# Altium schematic sheet CHC_Video.SchDoc
size C
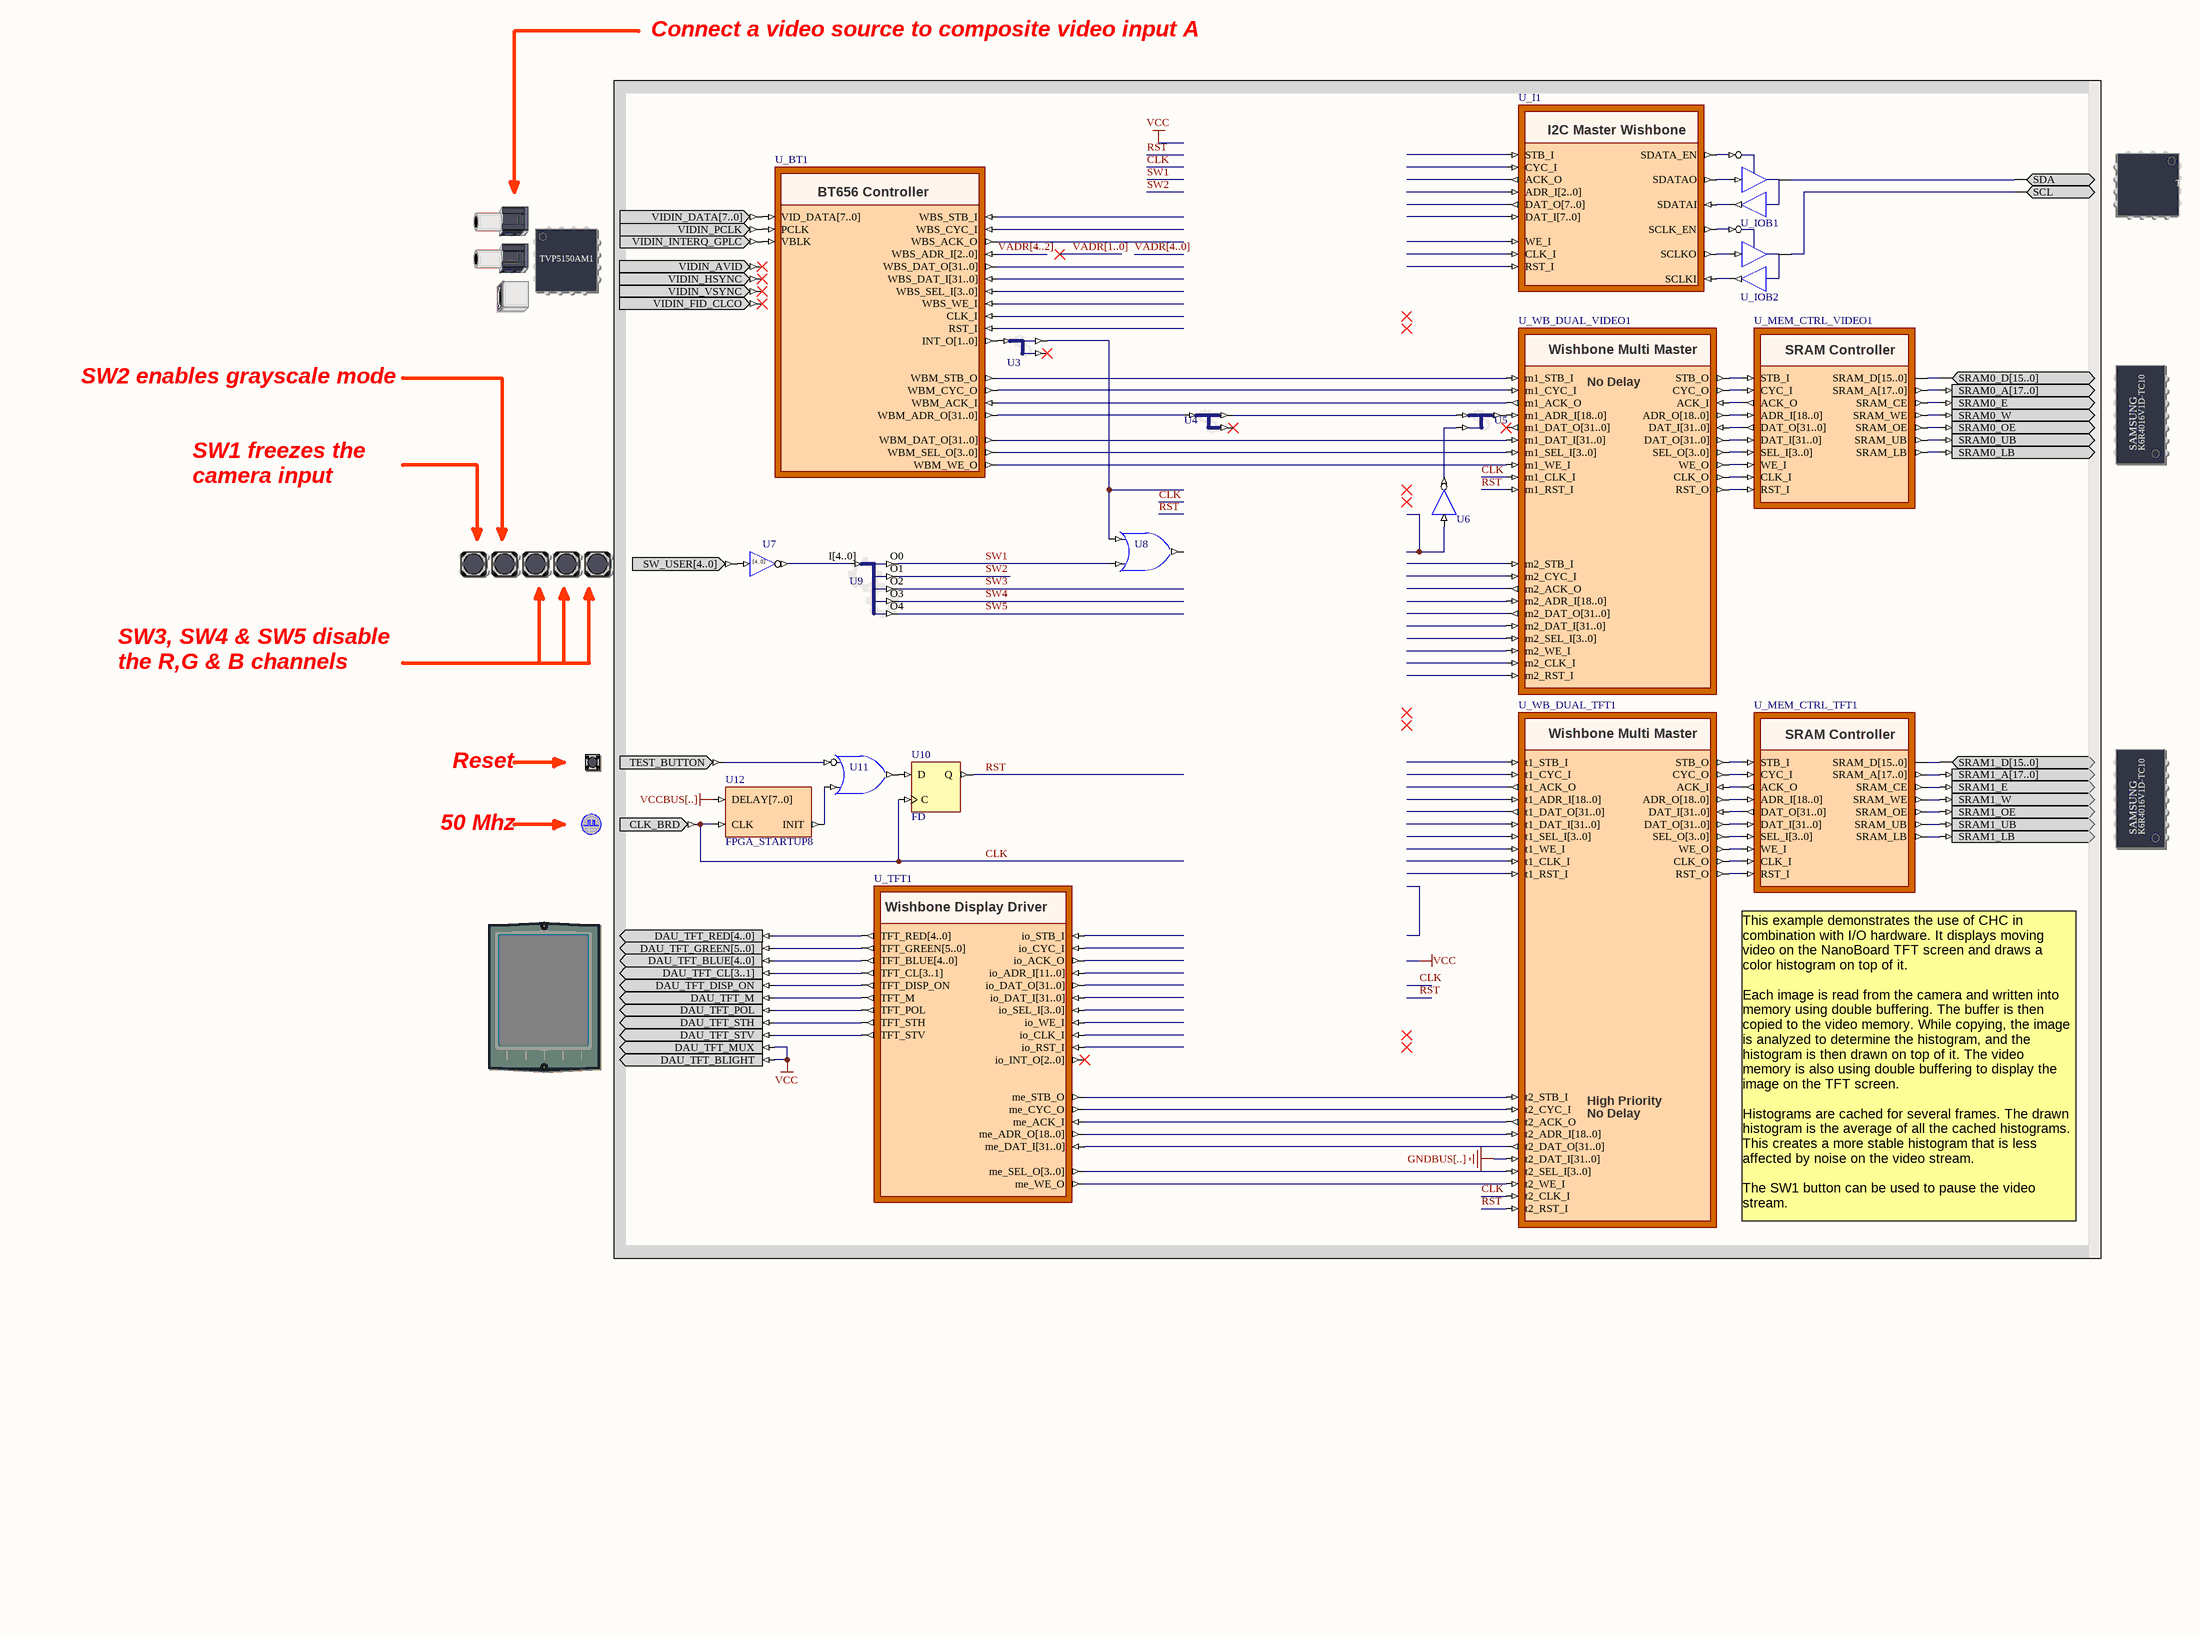
[diagram p0: CHC_Video.SchDoc]

## Parts
(Parts that share a designator on the sheet are numbered #1, #2 ... from top to bottom, then left to right.)
?#1  VIDEO_INPUT_CTRL  (value not drawn)
?#2  VIDEO_INPUT  (value not drawn)
?#3  SRAM_DAUGHTER0  (value not drawn)
?#4  USER_BUTTONS  (value not drawn)
?#5  TEST_BUTTON  (value not drawn)
?#6  SRAM_DAUGHTER1  (value not drawn)
?#7  CLOCK_BOARD  (value not drawn)
?#8  TFT_LCD  (value not drawn)
U3  BUS_JS  (value not drawn)
U4  BUS_JS  (value not drawn)
U5  BUS_JS  (value not drawn)
U6  INV  (value not drawn)
U7  INV5B  (value not drawn)
U8  OR2S  (value not drawn)
U9  BUS_JS  (value not drawn)
U10  FD
U11  OR2N1S  (value not drawn)
U12  FPGA_STARTUP8
U_BT1  BT656  (value not drawn)
U_I1  I2CM_W  (value not drawn)
U_IOB1  IOBUF  (value not drawn)
U_IOB2  IOBUF  (value not drawn)
U_MEM_CTRL_TFT1  WB_MEM_CTRL  (value not drawn)
U_MEM_CTRL_VIDEO1  WB_MEM_CTRL  (value not drawn)
U_TFT1  WB_VGA  (value not drawn)
U_WB_DUAL_TFT1  WB_MULTIMASTER  (value not drawn)
U_WB_DUAL_VIDEO1  WB_MULTIMASTER  (value not drawn)

## Nets
GNDBUS[..]: U_WB_DUAL_TFT1.t2_DAT_I[31..0]
VCC: ?#8.DAU_TFT_BLIGHT ?#8.DAU_TFT_MUX
VCCBUS[..]: U12.DELAY[7..0]
CLK: ?#7.CLK_BRD U10.C U12.CLK U_WB_DUAL_TFT1.t2_CLK_I U_WB_DUAL_VIDEO1.m1_CLK_I
RST: U10.Q U_WB_DUAL_TFT1.t2_RST_I U_WB_DUAL_VIDEO1.m1_RST_I
SW1: U8.I1 U9.O0
SW2: U9.O1
SW3: U9.O2
SW4: U9.O3
SW5: U9.O4
VADR[4..2]: U_BT1.WBS_ADR_I[2..0]
Net?#1_SCL: ?#1.SCL U_IOB2.IO
Net?#1_SDA: ?#1.SDA U_IOB1.IO
Net?#2_VIDIN_DATA[7..0]: ?#2.VIDIN_DATA[7..0] U_BT1.VID_DATA[7..0]
Net?#2_VIDIN_INTERQ_GPLC: ?#2.VIDIN_INTERQ_GPLC U_BT1.VBLK
Net?#2_VIDIN_PCLK: ?#2.VIDIN_PCLK U_BT1.PCLK
Net?#3_SRAM0_A[17..0]: ?#3.SRAM0_A[17..0] U_MEM_CTRL_VIDEO1.SRAM_A[17..0]
Net?#3_SRAM0_D[15..0]: ?#3.SRAM0_D[15..0] U_MEM_CTRL_VIDEO1.SRAM_D[15..0]
Net?#3_SRAM0_E: ?#3.SRAM0_E U_MEM_CTRL_VIDEO1.SRAM_CE
Net?#3_SRAM0_LB: ?#3.SRAM0_LB U_MEM_CTRL_VIDEO1.SRAM_LB
Net?#3_SRAM0_OE: ?#3.SRAM0_OE U_MEM_CTRL_VIDEO1.SRAM_OE
Net?#3_SRAM0_UB: ?#3.SRAM0_UB U_MEM_CTRL_VIDEO1.SRAM_UB
Net?#3_SRAM0_W: ?#3.SRAM0_W U_MEM_CTRL_VIDEO1.SRAM_WE
Net?#4_SW_USER[4..0]: ?#4.SW_USER[4..0] U7.I[4..0]
Net?#5_TEST_BUTTON: ?#5.TEST_BUTTON U11.I0
Net?#6_SRAM1_A[17..0]: ?#6.SRAM1_A[17..0] U_MEM_CTRL_TFT1.SRAM_A[17..0]
Net?#6_SRAM1_D[15..0]: ?#6.SRAM1_D[15..0] U_MEM_CTRL_TFT1.SRAM_D[15..0]
Net?#6_SRAM1_E: ?#6.SRAM1_E U_MEM_CTRL_TFT1.SRAM_CE
Net?#6_SRAM1_LB: ?#6.SRAM1_LB U_MEM_CTRL_TFT1.SRAM_LB
Net?#6_SRAM1_OE: ?#6.SRAM1_OE U_MEM_CTRL_TFT1.SRAM_OE
Net?#6_SRAM1_UB: ?#6.SRAM1_UB U_MEM_CTRL_TFT1.SRAM_UB
Net?#6_SRAM1_W: ?#6.SRAM1_W U_MEM_CTRL_TFT1.SRAM_WE
Net?#8_DAU_TFT_BLUE[4..0]: ?#8.DAU_TFT_BLUE[4..0] U_TFT1.TFT_BLUE[4..0]
Net?#8_DAU_TFT_CL[3..1]: ?#8.DAU_TFT_CL[3..1] U_TFT1.TFT_CL[3..1]
Net?#8_DAU_TFT_DISP_ON: ?#8.DAU_TFT_DISP_ON U_TFT1.TFT_DISP_ON
Net?#8_DAU_TFT_GREEN[5..0]: ?#8.DAU_TFT_GREEN[5..0] U_TFT1.TFT_GREEN[5..0]
Net?#8_DAU_TFT_M: ?#8.DAU_TFT_M U_TFT1.TFT_M
Net?#8_DAU_TFT_POL: ?#8.DAU_TFT_POL U_TFT1.TFT_POL
Net?#8_DAU_TFT_RED[4..0]: ?#8.DAU_TFT_RED[4..0] U_TFT1.TFT_RED[4..0]
Net?#8_DAU_TFT_STH: ?#8.DAU_TFT_STH U_TFT1.TFT_STH
Net?#8_DAU_TFT_STV: ?#8.DAU_TFT_STV U_TFT1.TFT_STV
NetU3_I[1..0]: U3.I[1..0] U_BT1.INT_O[1..0]
NetU3_O0: U3.O0 U8.I0
NetU4_I[31..0]: U4.I[31..0] U_BT1.WBM_ADR_O[31..0]
NetU4_O0_B[17..0]: U4.O0_B[17..0] U5.I0_B[17..0]
NetU5_I1: U5.I1 U6.O
NetU5_O[18..0]: U5.O[18..0] U_WB_DUAL_VIDEO1.m1_ADR_I[18..0]
NetU7_O[4..0]: U7.O[4..0] U9.I[4..0]
NetU10_D: U10.D U11.O
NetU11_I1: U11.I1 U12.INIT
NetU_BT1_WBM_ACK_I: U_BT1.WBM_ACK_I U_WB_DUAL_VIDEO1.m1_ACK_O
NetU_BT1_WBM_CYC_O: U_BT1.WBM_CYC_O U_WB_DUAL_VIDEO1.m1_CYC_I
NetU_BT1_WBM_DAT_O[31..0]: U_BT1.WBM_DAT_O[31..0] U_WB_DUAL_VIDEO1.m1_DAT_I[31..0]
NetU_BT1_WBM_SEL_O[3..0]: U_BT1.WBM_SEL_O[3..0] U_WB_DUAL_VIDEO1.m1_SEL_I[3..0]
NetU_BT1_WBM_STB_O: U_BT1.WBM_STB_O U_WB_DUAL_VIDEO1.m1_STB_I
NetU_BT1_WBM_WE_O: U_BT1.WBM_WE_O U_WB_DUAL_VIDEO1.m1_WE_I
NetU_I1_SCLK_EN: U_I1.SCLK_EN U_IOB2.T
NetU_I1_SCLKI: U_I1.SCLKI U_IOB2.O
NetU_I1_SCLKO: U_I1.SCLKO U_IOB2.I
NetU_I1_SDATA_EN: U_I1.SDATA_EN U_IOB1.T
NetU_I1_SDATAI: U_I1.SDATAI U_IOB1.O
NetU_I1_SDATAO: U_I1.SDATAO U_IOB1.I
NetU_MEM_CTRL_TFT1_ACK_O: U_MEM_CTRL_TFT1.ACK_O U_WB_DUAL_TFT1.ACK_I
NetU_MEM_CTRL_TFT1_ADR_I[18..0]: U_MEM_CTRL_TFT1.ADR_I[18..0] U_WB_DUAL_TFT1.ADR_O[18..0]
NetU_MEM_CTRL_TFT1_CLK_I: U_MEM_CTRL_TFT1.CLK_I U_WB_DUAL_TFT1.CLK_O
NetU_MEM_CTRL_TFT1_CYC_I: U_MEM_CTRL_TFT1.CYC_I U_WB_DUAL_TFT1.CYC_O
NetU_MEM_CTRL_TFT1_DAT_I[31..0]: U_MEM_CTRL_TFT1.DAT_I[31..0] U_WB_DUAL_TFT1.DAT_O[31..0]
NetU_MEM_CTRL_TFT1_DAT_O[31..0]: U_MEM_CTRL_TFT1.DAT_O[31..0] U_WB_DUAL_TFT1.DAT_I[31..0]
NetU_MEM_CTRL_TFT1_RST_I: U_MEM_CTRL_TFT1.RST_I U_WB_DUAL_TFT1.RST_O
NetU_MEM_CTRL_TFT1_SEL_I[3..0]: U_MEM_CTRL_TFT1.SEL_I[3..0] U_WB_DUAL_TFT1.SEL_O[3..0]
NetU_MEM_CTRL_TFT1_STB_I: U_MEM_CTRL_TFT1.STB_I U_WB_DUAL_TFT1.STB_O
NetU_MEM_CTRL_TFT1_WE_I: U_MEM_CTRL_TFT1.WE_I U_WB_DUAL_TFT1.WE_O
NetU_MEM_CTRL_VIDEO1_ACK_O: U_MEM_CTRL_VIDEO1.ACK_O U_WB_DUAL_VIDEO1.ACK_I
NetU_MEM_CTRL_VIDEO1_ADR_I[18..0]: U_MEM_CTRL_VIDEO1.ADR_I[18..0] U_WB_DUAL_VIDEO1.ADR_O[18..0]
NetU_MEM_CTRL_VIDEO1_CLK_I: U_MEM_CTRL_VIDEO1.CLK_I U_WB_DUAL_VIDEO1.CLK_O
NetU_MEM_CTRL_VIDEO1_CYC_I: U_MEM_CTRL_VIDEO1.CYC_I U_WB_DUAL_VIDEO1.CYC_O
NetU_MEM_CTRL_VIDEO1_DAT_I[31..0]: U_MEM_CTRL_VIDEO1.DAT_I[31..0] U_WB_DUAL_VIDEO1.DAT_O[31..0]
NetU_MEM_CTRL_VIDEO1_DAT_O[31..0]: U_MEM_CTRL_VIDEO1.DAT_O[31..0] U_WB_DUAL_VIDEO1.DAT_I[31..0]
NetU_MEM_CTRL_VIDEO1_RST_I: U_MEM_CTRL_VIDEO1.RST_I U_WB_DUAL_VIDEO1.RST_O
NetU_MEM_CTRL_VIDEO1_SEL_I[3..0]: U_MEM_CTRL_VIDEO1.SEL_I[3..0] U_WB_DUAL_VIDEO1.SEL_O[3..0]
NetU_MEM_CTRL_VIDEO1_STB_I: U_MEM_CTRL_VIDEO1.STB_I U_WB_DUAL_VIDEO1.STB_O
NetU_MEM_CTRL_VIDEO1_WE_I: U_MEM_CTRL_VIDEO1.WE_I U_WB_DUAL_VIDEO1.WE_O
NetU_TFT1_me_ACK_I: U_TFT1.me_ACK_I U_WB_DUAL_TFT1.t2_ACK_O
NetU_TFT1_me_ADR_O[18..0]: U_TFT1.me_ADR_O[18..0] U_WB_DUAL_TFT1.t2_ADR_I[18..0]
NetU_TFT1_me_CYC_O: U_TFT1.me_CYC_O U_WB_DUAL_TFT1.t2_CYC_I
NetU_TFT1_me_DAT_I[31..0]: U_TFT1.me_DAT_I[31..0] U_WB_DUAL_TFT1.t2_DAT_O[31..0]
NetU_TFT1_me_SEL_O[3..0]: U_TFT1.me_SEL_O[3..0] U_WB_DUAL_TFT1.t2_SEL_I[3..0]
NetU_TFT1_me_STB_O: U_TFT1.me_STB_O U_WB_DUAL_TFT1.t2_STB_I
NetU_TFT1_me_WE_O: U_TFT1.me_WE_O U_WB_DUAL_TFT1.t2_WE_I

Not connected (* = marked no-connect by the designer): ?#2 VIDIN_AVID* VIDIN_FID_CLCO* VIDIN_HSYNC* VIDIN_VSYNC*; U3 O1*; U4 O1_B[13..0]*; U6 I; U8 O; U_BT1 CLK_I RST_I WBS_ACK_O WBS_CYC_I WBS_DAT_I[31..0] WBS_DAT_O[31..0] WBS_SEL_I[3..0] WBS_STB_I WBS_WE_I; U_I1 ACK_O ADR_I[2..0] CLK_I CYC_I DAT_I[7..0] DAT_O[7..0] INT_O RST_I STB_I WE_I; U_TFT1 io_ACK_O io_ADR_I[11..0] io_CLK_I io_CYC_I io_DAT_I[31..0] io_DAT_O[31..0] io_INT_O[2..0]* io_RST_I io_SEL_I[3..0] io_STB_I io_WE_I; U_WB_DUAL_TFT1 t1_ACK_O t1_ADR_I[18..0] t1_CLK_I t1_CYC_I t1_DAT_I[31..0] t1_DAT_O[31..0] t1_RST_I t1_SEL_I[3..0] t1_STB_I t1_WE_I; U_WB_DUAL_VIDEO1 m1_DAT_O[31..0]* m2_ACK_O m2_ADR_I[18..0] m2_CLK_I m2_CYC_I m2_DAT_I[31..0] m2_DAT_O[31..0] m2_RST_I m2_SEL_I[3..0] m2_STB_I m2_WE_I

## Buses and harness runs
bus VADR[1..0]
bus VADR[4..0]
bus VADR[4..2]

## Notes on the sheet
- Connect a video source to composite video input A
- SW2 enables grayscale mode
- SW1 freezes the
- camera input
- SW3, SW4 & SW5 disable
- the R,G & B channels
- Reset
- 50 Mhz
- This example demonstrates the use of CHC in combination with I/O hardware. It displays moving video on the NanoBoard TFT screen and draws a color histogram on top of it.
  Each image is read from the camera and written into memory using double buffering. The buffer is then copied to the video memory. While copying, the image is analyzed to determine the histogram, and the histogram is then drawn on top of it. The video memory is also using double buffering to display the image on the TFT screen.
  Histograms are cached for several frames. The drawn histogram is the average of all the cached histograms. This creates a more stable histogram that is less affected by noise on the video stream.
  The SW1 button can be used to pause the video stream.
- Title
- Size:
- Date:
- File:
- C
- Number:
- Time:
- Revision:
- Sheet
- of
- (in symbol BT656) BT656 Controller
- (in symbol INV5B) [4..0]
- (in symbol SRAM_DAUGHTER0) SAMSUNG; K6R4016V1D-TC10
- (in symbol SRAM_DAUGHTER1) SAMSUNG; K6R4016V1D-TC10
- (in symbol VIDEO_INPUT) TVP5150AM1
- (in symbol VIDEO_INPUT_CTRL) TVP5150AM1
- (in symbol WB_MEM_CTRL) SRAM Controller
- (in symbol WB_MULTIMASTER) Wishbone Multi Master; High Priority; No Delay

## Library data of the parts
?#1 = VIDEO_INPUT_CTRL: Video Input Control; PortComponent: True; Published: 22-Jan-2007; Publisher: Altium Limited; HelpURL: TR0145 Technical Reference for Altium's Audio-Video Peripheral Board PB01.pdf#page=8
?#2 = VIDEO_INPUT: Video Inputs; PortComponent: True; Published: 22-Jan-2007; Publisher: Altium Limited; HelpURL: TR0145 Technical Reference for Altium's Audio-Video Peripheral Board PB01.pdf#page=7
?#3 = SRAM_DAUGHTER0: Free Static RAM - Daughterboard; PortComponent: True; Published: 14-May-2007; Publisher: Altium Limited; HelpURL: TR0149 Technical Reference for Altium's Xilinx Spartan-3 Daughter Board DB30.pdf#page=16
?#4 = USER_BUTTONS: Generic User Buttons; PortComponent: True; Published: 16-Apr-2007; Publisher: Altium Limited; HelpURL: TR0143 Technical Reference Manual for Altium's Desktop NanoBoard NB2DSK01.pdf#page=53
?#5 = TEST_BUTTON: Test / Reset Button; PortComponent: True; Published: 19-Nov-2003; Publisher: Altium Limited; HelpURL: TR0143 Technical Reference Manual for Altium's Desktop NanoBoard NB2DSK01.pdf#page=53
?#6 = SRAM_DAUGHTER1: Free Static RAM - Daughterboard; PortComponent: True; Published: 14-May-2007; Publisher: Altium Limited; HelpURL: TR0149 Technical Reference for Altium's Xilinx Spartan-3 Daughter Board DB30.pdf#page=16
?#7 = CLOCK_BOARD: Global System Clock Supply; PortComponent: True; Published: 19-Nov-2003; Publisher: Altium Limited; HelpURL: TR0143 Technical Reference Manual for Altium's Desktop NanoBoard NB2DSK01.pdf#page=41; UseInDSF: True
?#8 = TFT_LCD: TFT LCD Panel; PortComponent: True; Published: 22-Jan-2007; Publisher: Altium Limited; HelpURL: TR0143 Technical Reference Manual for Altium's Desktop NanoBoard NB2DSK01.pdf#page=50
U3 = BUS_JS: Configurable Bus Joiner/Splitter; ConfiguratorName: GENERIC_BUS_JS; ConfigurationParameters: {}Version[1.1]{}SplitterJoinerType[Splitter]{}SignalCount[2]{}SignalWidth0[1]{}GapBelow0[1000000]{}ConnectionType0[Pin]{}SignalWidth1[1]{}GapBelow1[1000000]{}ConnectionType1[Pin]{}ShowPinNames[False]{}; LastRevisionNo: 1.00.00; Published: 17-Sep-2008; Publisher: Altium Limited
U4 = BUS_JS: Configurable Bus Joiner/Splitter; ConfiguratorName: GENERIC_BUS_JS; ConfigurationParameters: {}Version[1.1]{}SplitterJoinerType[Splitter]{}SignalCount[2]{}SignalWidth0[18]{}GapBelow0[1000000]{}ConnectionType0[Pin]{}SignalWidth1[14]{}GapBelow1[1000000]{}ConnectionType1[Pin]{}ShowPinNames[False]{}; LastRevisionNo: 1.00.00; Published: 17-Sep-2008; Publisher: Altium Limited
U5 = BUS_JS: Configurable Bus Joiner/Splitter; ConfiguratorName: GENERIC_BUS_JS; ConfigurationParameters: {}Version[1.1]{}SplitterJoinerType[Joiner]{}SignalCount[2]{}SignalWidth0[18]{}GapBelow0[1000000]{}ConnectionType0[Pin]{}SignalWidth1[1]{}GapBelow1[1000000]{}ConnectionType1[Pin]{}ShowPinNames[False]{}; LastRevisionNo: 1.00.00; Published: 17-Sep-2008; Publisher: Altium Limited
U6 = INV: Inverter; FunctionalClass: Logic Primitive; ArchiveName: GENERIC; VHDLIB_SIM: GENERIC_LIB; Published: 29-Jan-2004; Publisher: Altium Limited; XilinxEquivalent: INV; LastRevisionNo: 1.00.00; HelpURL: CR0118 FPGA Generic Library Guide.pdf#page=291; ComponentLink1URL: CR0136 FPGA Logic Primitive Resource Usage.pdf#page=61; ComponentLink1Description: Core &Resource Usage; SubClass: INV
U7 = INV5B: 5-Bit Inverter, Bus Version; FunctionalClass: Logic Primitive; SubClass: INV; PortSize: 5; ArchiveName: GENERIC; VHDLIB_SIM: GENERIC_LIB; Published: 29-Jan-2004; Publisher: Altium Limited; LastRevisionNo: 1.00.00; HelpURL: CR0118 FPGA Generic Library Guide.pdf#page=291; ComponentLink1URL: CR0136 FPGA Logic Primitive Resource Usage.pdf#page=68; ComponentLink1Description: Core &Resource Usage; PortStyle: Bus Version
U8 = OR2S: 2-Input OR Gate, Single Pin Version; XilinxEquivalent: OR2; FunctionalClass: Logic Primitive; PortSize: 2; ArchiveName: GENERIC; VHDLIB_SIM: GENERIC_LIB; Published: 29-Jan-2004; Publisher: Altium Limited; LastRevisionNo: 1.00.00; HelpURL: CR0118 FPGA Generic Library Guide.pdf#page=410; ComponentLink1URL: CR0136 FPGA Logic Primitive Resource Usage.pdf#page=190; ComponentLink1Description: Core &Resource Usage; SubClass: OR; PortStyle: Single Pin Version
U9 = BUS_JS: Configurable Bus Joiner/Splitter; ConfiguratorName: GENERIC_BUS_JS; ConfigurationParameters: {}Version[1.1]{}SplitterJoinerType[Splitter]{}SignalCount[5]{}SignalWidth0[1]{}GapBelow0[1000000]{}ConnectionType0[Pin]{}SignalWidth1[1]{}GapBelow1[1000000]{}ConnectionType1[Pin]{}SignalWidth2[1]{}GapBelow2[1000000]{}ConnectionType2[Pin]{}SignalWidth3[1]{}GapBelow3[1000000]{}ConnectionType3[Pin]{}SignalWidth4[1]{}GapBelow4[1000000]{}ConnectionType4[Pin]{}ShowPinNames[True]{}; LastRevisionNo: 1.00.00; Published: 17-Sep-2008; Publisher: Altium Limited
U10 = FD: D-Type Flip-Flop; ClockTrigger: Rising; ArchiveName: GENERIC; VHDLIB_SIM: GENERIC_LIB; Published: 29-Jan-2004; Publisher: Altium Limited; XilinxEquivalent: FD; LastRevisionNo: 1.00.00; HelpURL: CR0118 FPGA Generic Library Guide.pdf#page=170; ComponentLink1URL: CR0133 FPGA Flip Flop Resource Usage.pdf#page=4; ComponentLink1Description: Core &Resource Usage; FunctionalClass: Flip-Flop; SubClass: FD
U11 = OR2N1S: 2-Input OR Gate with Active Low A Input, Single Pin Version; XilinxEquivalent: OR2B1; FunctionalClass: Logic Primitive; PortSize: 2; ArchiveName: GENERIC; VHDLIB_SIM: GENERIC_LIB; Published: 29-Jan-2004; Publisher: Altium Limited; LastRevisionNo: 1.00.00; HelpURL: CR0118 FPGA Generic Library Guide.pdf#page=410; ComponentLink1URL: CR0136 FPGA Logic Primitive Resource Usage.pdf#page=187; ComponentLink1Description: Core &Resource Usage; SubClass: OR; PortStyle: Single Pin Version
U12 = FPGA_STARTUP8: FPGA Startup With 8 Bit Delay; Published: 9-Dec-2004; Publisher: Altium Limited; HelpURL: CR0119 FPGA_STARTUPx Powerup Delay Unit.pdf; LastRevisionNo: 1.00.00; ComponentLink1Description: Core &Resource Usage; ComponentLink1URL: CR0139 FPGA Peripheral Resource Usage.pdf#page=11
U_BT1 = BT656: Wishbone BT656 Controller; UseInDSF: True; ComponentLink1Description: Core &Resource Usage; ComponentLink1URL: CR0139 FPGA Peripheral Resource Usage.pdf#page=2; HelpURL: CR0159 BT656 Video Capture Controller.pdf; LastRevisionNo: 1.00.00; Published: 27-Mar-2005; Publisher: Altium Limited
U_I1 = WB_I2CM: I2C Master Wishbone; UseInDSF: True; Published: 9-Dec-2004; Publisher: Altium Limited; ComponentLink1Description: Core &Resource Usage; ComponentLink1URL: CR0139 FPGA Peripheral Resource Usage.pdf#page=17; HelpURL: CR0105 I2CM Controller.pdf; LastRevisionNo: 1.00.00
U_IOB1 U_IOB2 = IOBUF: Input/Output Buffer; Enable: Low; Control: Common Control T; ArchiveName: GENERIC; VHDLIB_SIM: GENERIC_LIB; Published: 29-Jan-2004; Publisher: Altium Limited; XilinxEquivalent: IOBUF; LastRevisionNo: 1.00.00; HelpURL: CR0118 FPGA Generic Library Guide.pdf#page=293; ComponentLink1URL: CR0125 FPGA Buffer Resource Usage.pdf#page=78; ComponentLink1Description: Core &Resource Usage; FunctionalClass: Buffer; SubClass: IOBUF
U_MEM_CTRL_TFT1 U_MEM_CTRL_VIDEO1 = WB_MEM_CTRL: Configurable Memory Controller; ConfigurationParameters: {}Version[1.0]{}Option_MemoryType[Asynchronous SRAM]{}Option_MemorySize[512 KB (128K x 32-bit)]{}Option_Layout[1 x 16-bit Wide Device]{}Option_Read[2]{}Option_WriteSetup[1]{}Option_WritePulse[1]{}Option_WriteHold[1]{}Option_FlashRead[4]{}Option_FlashWriteSetup[1]{}Option_FlashWritePulse[5]{}Option_FlashWriteHold[1]{}Option_SdramKeepRowOpen[0]{}Option_SdramClock[100]{}Option_SdramWriteRecovery[4]{}Option_SdramAutoRefresh[16]{}Option_SdramActiveToReadWrite[8]{}Option_SdramPrecharge[16]{}Option_SdramCasLatency[2]{}Option_SdramClockScheme[0]{}; UseInDSF: True; ComponentLink1Description: Core &Resource Usage; ComponentLink1URL: CR0139 FPGA Peripheral Resource Usage.pdf#page=85; HelpURL: CR0152 WB_MEM_CTRL Configurable Wishbone Memory Controller.pdf; LastRevisionNo: 1.00.00; Published: 9-Dec-2004; Publisher: Altium Limited; ConfiguratorName: WB_MEM_CTRL
U_TFT1 = VGA32_TFT: Wishbone Display Driver; UseInDSF: True; ConfigurationParameters: {}Version[1.0]{}VgaKind[VGA32_TFT]{}Orientation[Left]{}ExtraSpace[2]{}AddressWidth[19]{}; ConfiguratorName: WB_VGA; ComponentLink1Description: Core &Resource Usage; ComponentLink1URL: CR0139 FPGA Peripheral Resource Usage.pdf#page=46; HelpURL: CR0167 WB_VGA Configurable Wishbone Display Driver.pdf; LastRevisionNo: 1.00.00; Published: 27-Mar-2005; Publisher: Altium Limited
U_WB_DUAL_TFT1 = WB_MULTIMASTER: Configurable Wishbone Multi Master; ConfigurationParameters: {}Version[1.0]{}DataWidth[0]{}AddressWidth[19]{}SpaceAfter[18,10]{}DualType[1]{}MasterNames[t1,t2]{}PriorityDevice[2,1]{}Masters[2]{}ZeroDelay[t2]{}Interrupts[False]; ComponentLink1Description: Core &Resource Usage; ComponentLink1URL: CR0139 FPGA Peripheral Resource Usage.pdf#page=96; HelpURL: CR0168 WB_MULTIMASTER Configurable Wishbone Multi-Master.pdf; LastRevisionNo: 1.00.00; Published: 27-Mar-2005; Publisher: Altium Limited; ConfiguratorName: WB_MULTIMASTER
U_WB_DUAL_VIDEO1 = WB_MULTIMASTER: Configurable Wishbone Multi Master; ConfigurationParameters: {}Version[1.0]{}DataWidth[0]{}AddressWidth[19]{}SpaceAfter[6,10]{}DualType[0]{}MasterNames[m1,m2]{}PriorityDevice[1,2]{}Masters[2]{}ZeroDelay[m1]{}Interrupts[False]; ComponentLink1Description: Core &Resource Usage; ComponentLink1URL: CR0139 FPGA Peripheral Resource Usage.pdf#page=96; HelpURL: CR0168 WB_MULTIMASTER Configurable Wishbone Multi-Master.pdf; LastRevisionNo: 1.00.00; Published: 27-Mar-2005; Publisher: Altium Limited; ConfiguratorName: WB_MULTIMASTER